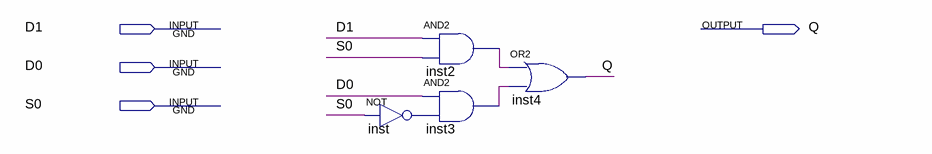
[diagram p0: schematic sheet]
// Quartus schematic MX2x1.bdf as structural Verilog: 4 symbols, 4 pins
module MX2x1 (
  input  D1,
  input  D0,
  input  S0,
  output Q
);

  wire inst2_out, inst3_out, inst_out;

  and inst2 (inst2_out, D1, S0);
  and inst3 (inst3_out, D0, inst_out);
  not inst (inst_out, S0);
  or inst4 (Q, inst2_out, inst3_out);
endmodule
